# EAGLE design schemathic (EAGLE 9.1.3)
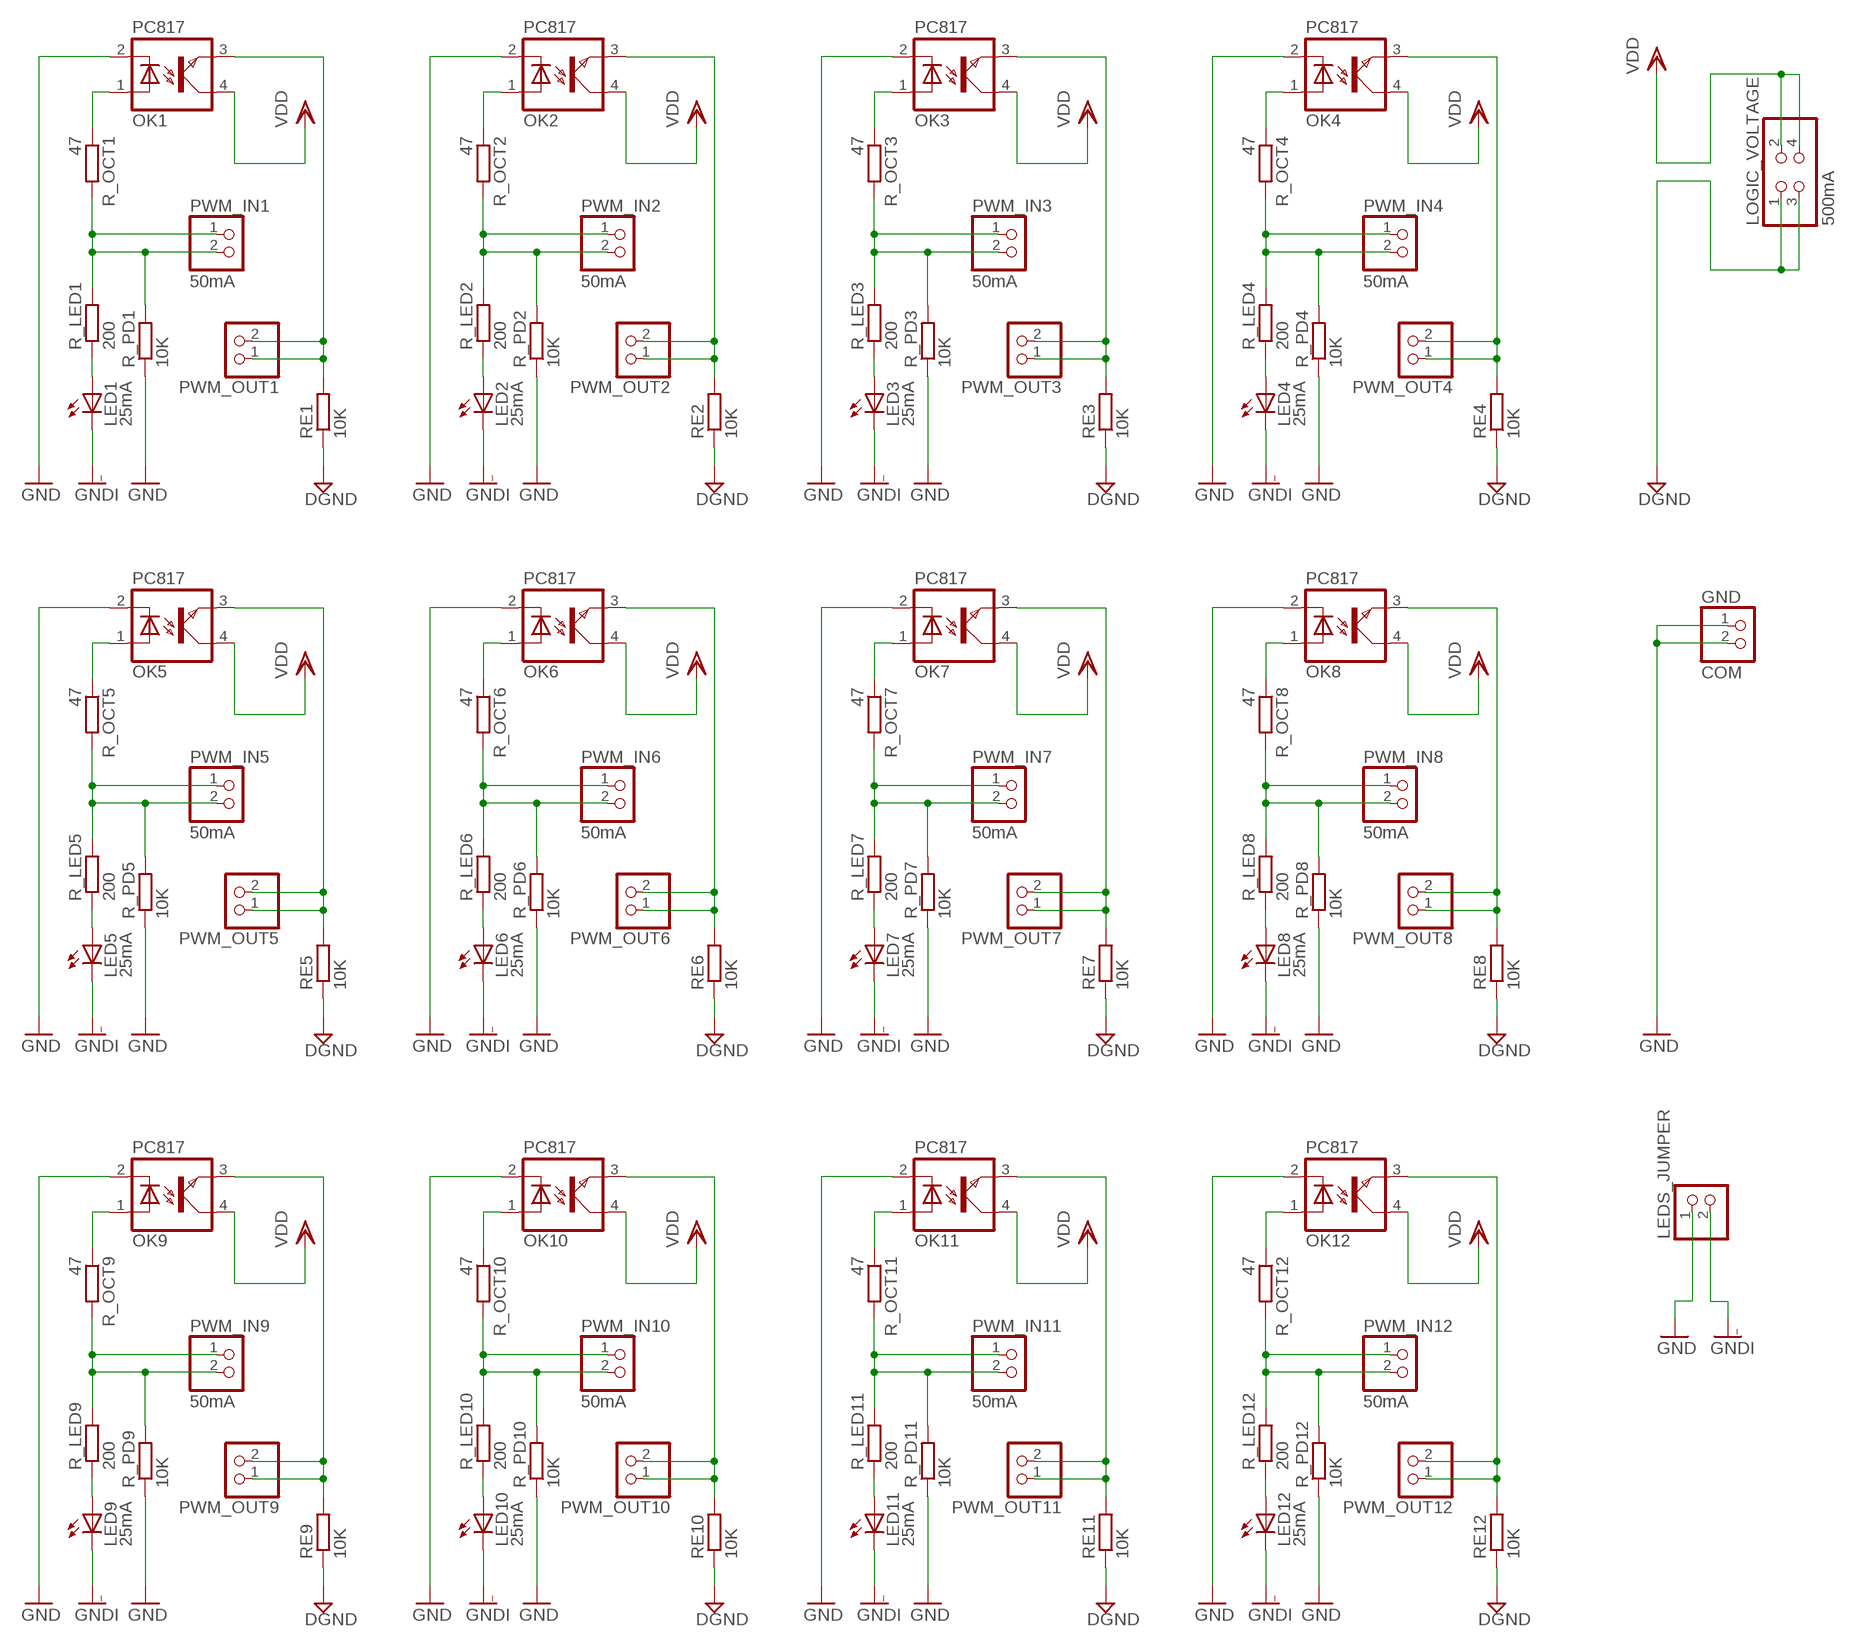
[diagram p0: schematic, sheet 1]

## Parts
GND  COM  PINHD-1X2  [1X02]
LED1  25mA  LED3MM  [LED3MM]
LED2  25mA  LED3MM  [LED3MM]
LED3  25mA  LED3MM  [LED3MM]
LED4  25mA  LED3MM  [LED3MM]
LED5  25mA  LED3MM  [LED3MM]
LED6  25mA  LED3MM  [LED3MM]
LED7  25mA  LED3MM  [LED3MM]
LED8  25mA  LED3MM  [LED3MM]
LED9  25mA  LED3MM  [LED3MM]
LED10  25mA  LED3MM  [LED3MM]
LED11  25mA  LED3MM  [LED3MM]
LED12  25mA  LED3MM  [LED3MM]
LEDS_JUMPER  PINHD-1X2  [1X02]
LOGIC_VOLTAGE  500mA  PINHD-2X2  [2X02]
OK1  PC817  [DIL04]
OK2  PC817  [DIL04]
OK3  PC817  [DIL04]
OK4  PC817  [DIL04]
OK5  PC817  [DIL04]
OK6  PC817  [DIL04]
OK7  PC817  [DIL04]
OK8  PC817  [DIL04]
OK9  PC817  [DIL04]
OK10  PC817  [DIL04]
OK11  PC817  [DIL04]
OK12  PC817  [DIL04]
PWM_IN1  50mA  PINHD-1X2  [1X02]
PWM_IN2  50mA  PINHD-1X2  [1X02]
PWM_IN3  50mA  PINHD-1X2  [1X02]
PWM_IN4  50mA  PINHD-1X2  [1X02]
PWM_IN5  50mA  PINHD-1X2  [1X02]
PWM_IN6  50mA  PINHD-1X2  [1X02]
PWM_IN7  50mA  PINHD-1X2  [1X02]
PWM_IN8  50mA  PINHD-1X2  [1X02]
PWM_IN9  50mA  PINHD-1X2  [1X02]
PWM_IN10  50mA  PINHD-1X2  [1X02]
PWM_IN11  50mA  PINHD-1X2  [1X02]
PWM_IN12  50mA  PINHD-1X2  [1X02]
PWM_OUT1  PINHD-1X2  [1X02]
PWM_OUT2  PINHD-1X2  [1X02]
PWM_OUT3  PINHD-1X2  [1X02]
PWM_OUT4  PINHD-1X2  [1X02]
PWM_OUT5  PINHD-1X2  [1X02]
PWM_OUT6  PINHD-1X2  [1X02]
PWM_OUT7  PINHD-1X2  [1X02]
PWM_OUT8  PINHD-1X2  [1X02]
PWM_OUT9  PINHD-1X2  [1X02]
PWM_OUT10  PINHD-1X2  [1X02]
PWM_OUT11  PINHD-1X2  [1X02]
PWM_OUT12  PINHD-1X2  [1X02]
R_LED1  200  R-EU_0204/7  [0204/7]
R_LED2  200  R-EU_0204/7  [0204/7]
R_LED3  200  R-EU_0204/7  [0204/7]
R_LED4  200  R-EU_0204/7  [0204/7]
R_LED5  200  R-EU_0204/7  [0204/7]
R_LED6  200  R-EU_0204/7  [0204/7]
R_LED7  200  R-EU_0204/7  [0204/7]
R_LED8  200  R-EU_0204/7  [0204/7]
R_LED9  200  R-EU_0204/7  [0204/7]
R_LED10  200  R-EU_0204/7  [0204/7]
R_LED11  200  R-EU_0204/7  [0204/7]
R_LED12  200  R-EU_0204/7  [0204/7]
R_OCT1  47  R-EU_0204/7  [0204/7]
R_OCT2  47  R-EU_0204/7  [0204/7]
R_OCT3  47  R-EU_0204/7  [0204/7]
R_OCT4  47  R-EU_0204/7  [0204/7]
R_OCT5  47  R-EU_0204/7  [0204/7]
R_OCT6  47  R-EU_0204/7  [0204/7]
R_OCT7  47  R-EU_0204/7  [0204/7]
R_OCT8  47  R-EU_0204/7  [0204/7]
R_OCT9  47  R-EU_0204/7  [0204/7]
R_OCT10  47  R-EU_0204/7  [0204/7]
R_OCT11  47  R-EU_0204/7  [0204/7]
R_OCT12  47  R-EU_0204/7  [0204/7]
R_PD1  10K  R-EU_0204/7  [0204/7]
R_PD2  10K  R-EU_0204/7  [0204/7]
R_PD3  10K  R-EU_0204/7  [0204/7]
R_PD4  10K  R-EU_0204/7  [0204/7]
R_PD5  10K  R-EU_0204/7  [0204/7]
R_PD6  10K  R-EU_0204/7  [0204/7]
R_PD7  10K  R-EU_0204/7  [0204/7]
R_PD8  10K  R-EU_0204/7  [0204/7]
R_PD9  10K  R-EU_0204/7  [0204/7]
R_PD10  10K  R-EU_0204/7  [0204/7]
R_PD11  10K  R-EU_0204/7  [0204/7]
R_PD12  10K  R-EU_0204/7  [0204/7]
RE1  10K  R-EU_0204/7  [0204/7]
RE2  10K  R-EU_0204/7  [0204/7]
RE3  10K  R-EU_0204/7  [0204/7]
RE4  10K  R-EU_0204/7  [0204/7]
RE5  10K  R-EU_0204/7  [0204/7]
RE6  10K  R-EU_0204/7  [0204/7]
RE7  10K  R-EU_0204/7  [0204/7]
RE8  10K  R-EU_0204/7  [0204/7]
RE9  10K  R-EU_0204/7  [0204/7]
RE10  10K  R-EU_0204/7  [0204/7]
RE11  10K  R-EU_0204/7  [0204/7]
RE12  10K  R-EU_0204/7  [0204/7]

## Nets
DGND: LOGIC_VOLTAGE.1 LOGIC_VOLTAGE.3 RE1.1 RE2.1 RE3.1 RE4.1 RE5.1 RE6.1 RE7.1 RE8.1 RE9.1 RE10.1 RE11.1 RE12.1
GND: GND.1 GND.2 LEDS_JUMPER.1 OK1.2(C) OK2.2(C) OK3.2(C) OK4.2(C) OK5.2(C) OK6.2(C) OK7.2(C) OK8.2(C) OK9.2(C) OK10.2(C) OK11.2(C) OK12.2(C) R_PD1.1 R_PD2.1 R_PD3.1 R_PD4.1 R_PD5.1 R_PD6.1 R_PD7.1 R_PD8.1 R_PD9.1 R_PD10.1 R_PD11.1 R_PD12.1
GNDI: LED1.K(C) LED2.K(C) LED3.K(C) LED4.K(C) LED5.K(C) LED6.K(C) LED7.K(C) LED8.K(C) LED9.K(C) LED10.K(C) LED11.K(C) LED12.K(C) LEDS_JUMPER.2
N$1: LED2.A R_LED2.1
N$2: LED1.A R_LED1.1
N$3: PWM_IN1.1 PWM_IN1.2 R_LED1.2 R_OCT1.2 R_PD1.2
N$4: OK1.1(A) R_OCT1.1
N$5: OK1.3(EMIT) PWM_OUT1.1 PWM_OUT1.2 RE1.2
N$6: PWM_IN2.1 PWM_IN2.2 R_LED2.2 R_OCT2.2 R_PD2.2
N$7: OK2.1(A) R_OCT2.1
N$8: OK2.3(EMIT) PWM_OUT2.1 PWM_OUT2.2 RE2.2
N$9: LED3.A R_LED3.1
N$10: PWM_IN3.1 PWM_IN3.2 R_LED3.2 R_OCT3.2 R_PD3.2
N$11: OK3.1(A) R_OCT3.1
N$12: OK3.3(EMIT) PWM_OUT3.1 PWM_OUT3.2 RE3.2
N$13: LED4.A R_LED4.1
N$14: PWM_IN4.1 PWM_IN4.2 R_LED4.2 R_OCT4.2 R_PD4.2
N$15: OK4.1(A) R_OCT4.1
N$16: OK4.3(EMIT) PWM_OUT4.1 PWM_OUT4.2 RE4.2
N$17: LED5.A R_LED5.1
N$18: PWM_IN5.1 PWM_IN5.2 R_LED5.2 R_OCT5.2 R_PD5.2
N$19: OK5.1(A) R_OCT5.1
N$20: OK5.3(EMIT) PWM_OUT5.1 PWM_OUT5.2 RE5.2
N$21: LED6.A R_LED6.1
N$22: PWM_IN6.1 PWM_IN6.2 R_LED6.2 R_OCT6.2 R_PD6.2
N$23: OK6.1(A) R_OCT6.1
N$24: OK6.3(EMIT) PWM_OUT6.1 PWM_OUT6.2 RE6.2
N$25: LED7.A R_LED7.1
N$26: PWM_IN7.1 PWM_IN7.2 R_LED7.2 R_OCT7.2 R_PD7.2
N$27: OK7.1(A) R_OCT7.1
N$28: OK7.3(EMIT) PWM_OUT7.1 PWM_OUT7.2 RE7.2
N$29: LED8.A R_LED8.1
N$30: PWM_IN8.1 PWM_IN8.2 R_LED8.2 R_OCT8.2 R_PD8.2
N$31: OK8.1(A) R_OCT8.1
N$32: OK8.3(EMIT) PWM_OUT8.1 PWM_OUT8.2 RE8.2
N$33: LED9.A R_LED9.1
N$34: PWM_IN9.1 PWM_IN9.2 R_LED9.2 R_OCT9.2 R_PD9.2
N$35: OK9.1(A) R_OCT9.1
N$36: OK9.3(EMIT) PWM_OUT9.1 PWM_OUT9.2 RE9.2
N$37: LED10.A R_LED10.1
N$38: PWM_IN10.1 PWM_IN10.2 R_LED10.2 R_OCT10.2 R_PD10.2
N$39: OK10.1(A) R_OCT10.1
N$40: OK10.3(EMIT) PWM_OUT10.1 PWM_OUT10.2 RE10.2
N$41: LED11.A R_LED11.1
N$42: PWM_IN11.1 PWM_IN11.2 R_LED11.2 R_OCT11.2 R_PD11.2
N$43: OK11.1(A) R_OCT11.1
N$44: OK11.3(EMIT) PWM_OUT11.1 PWM_OUT11.2 RE11.2
N$45: LED12.A R_LED12.1
N$46: PWM_IN12.1 PWM_IN12.2 R_LED12.2 R_OCT12.2 R_PD12.2
N$47: OK12.1(A) R_OCT12.1
N$48: OK12.3(EMIT) PWM_OUT12.1 PWM_OUT12.2 RE12.2
VDD: LOGIC_VOLTAGE.2 LOGIC_VOLTAGE.4 OK1.4(COL) OK2.4(COL) OK3.4(COL) OK4.4(COL) OK5.4(COL) OK6.4(COL) OK7.4(COL) OK8.4(COL) OK9.4(COL) OK10.4(COL) OK11.4(COL) OK12.4(COL)

## Library data of the parts
GND LEDS_JUMPER PWM_IN1-PWM_IN12 PWM_OUT1-PWM_OUT12 = pinhead:PINHD-1X2: PIN HEADER
LED1-LED12 = led:LED: LED OSRAM: - CHIPLED LG R971, LG N971, LY N971, LG Q971, LY Q971, LO R971, LY R971 LH N974, LH R974 LS Q976, LO Q976, LY Q976 LO Q996 - Hyper CHIPLED LW Q18S LB Q993, LB Q99A, LB R99A - SideLED LS A670, LO A670, LY A670, LG A670, LP A670 LB A673, LV A673, LT A673, LW A673 LH A674 LY A675 LS A676, LA A676, LO A676, LY A676, LW A676 LS A679, LY A679, LG A679 - Hyper Micro SIDELED® LS Y876, LA Y876, LO Y876, LY Y876 LT Y87S - SmartLED LW L88C, LW L88S LB L89C, LB L89S, LG L890 LS L89K, LO L89K, LY L89K LS L896, LA L896, LO L896, LY L896 - TOPLED LS T670, LO T670, LY T670, LG T670, LP T670 LSG T670, LSP T670, LSY T670, LOP T670, LYG T670 LG T671, LOG T671, LSG T671 LB T673, LV T673, LT T673, LW T673 LH T674 LS T676, LA T676, LO T676, LY T676, LB T676, LH T676, LSB T676, LW T676 LB T67C, LV T67C, LT T67C, LS T67K, LO T67K, LY T67K, LW E67C LS E67B, LA E67B, LO E67B, LY E67B, LB E67C, LV E67C, LT E67C LW T67C LS T679, LY T679, LG T679 LS T770, LO T770, LY T770, LG T770, LP T770 LB T773, LV T773, LT T773, LW T773 LH T774 LS E675, LA E675, LY E675, LS T675 LS T776, LA T776, LO T776, LY T776, LB T776 LHGB T686 LT T68C, LB T68C - Hyper Mini TOPLED® LB M676 - Mini TOPLED Santana® LG M470 LS M47K, LO M47K, LY M47K Source: http://www.osram.convergy.de LUXEON: - LUMILED® LXK2-PW12-R00, LXK2-PW12-S00, LXK2-PW14-U00, LXK2-PW14-V00 LXK2-PM12-R00, LXK2-PM12-S00, LXK2-PM14-U00 LXK2-PE12-Q00, LXK2-PE12-R00, LXK2-PE12-S00, LXK2-PE14-T00, LXK2-PE14-U00 LXK2-PB12-K00, LXK2-PB12-L00, LXK2-PB12-M00, LXK2-PB14-N00, LXK2-PB14-P00, LXK2-PB14-Q00 LXK2-PR12-L00, LXK2-PR12-M00, LXK2-PR14-Q00, LXK2-PR14-R00 LXK2-PD12-Q00, LXK2-PD12-R00, LXK2-PD12-S00 LXK2-PH12-R00, LXK2-PH12-S00 LXK2-PL12-P00, LXK2-PL12-Q00, LXK2-PL12-R00 Source: www.luxeon.com KINGBRIGHT: KA-3528ASYC Source: www.kingbright.com
LOGIC_VOLTAGE = pinhead:PINHD-2X2: PIN HEADER
OK1-OK12 = optocoupler:PC817: SHARP OPTO COUPLER; MPN: PC817X4J000F; OC_FARNELL: 9707727; OC_NEWARK: 97K7059
R_LED1-R_LED12 R_OCT1-R_OCT12 R_PD1-R_PD12 RE1-RE12 = rcl:R-EU_: RESISTOR, European symbol; SPICEPREFIX: R

## Board
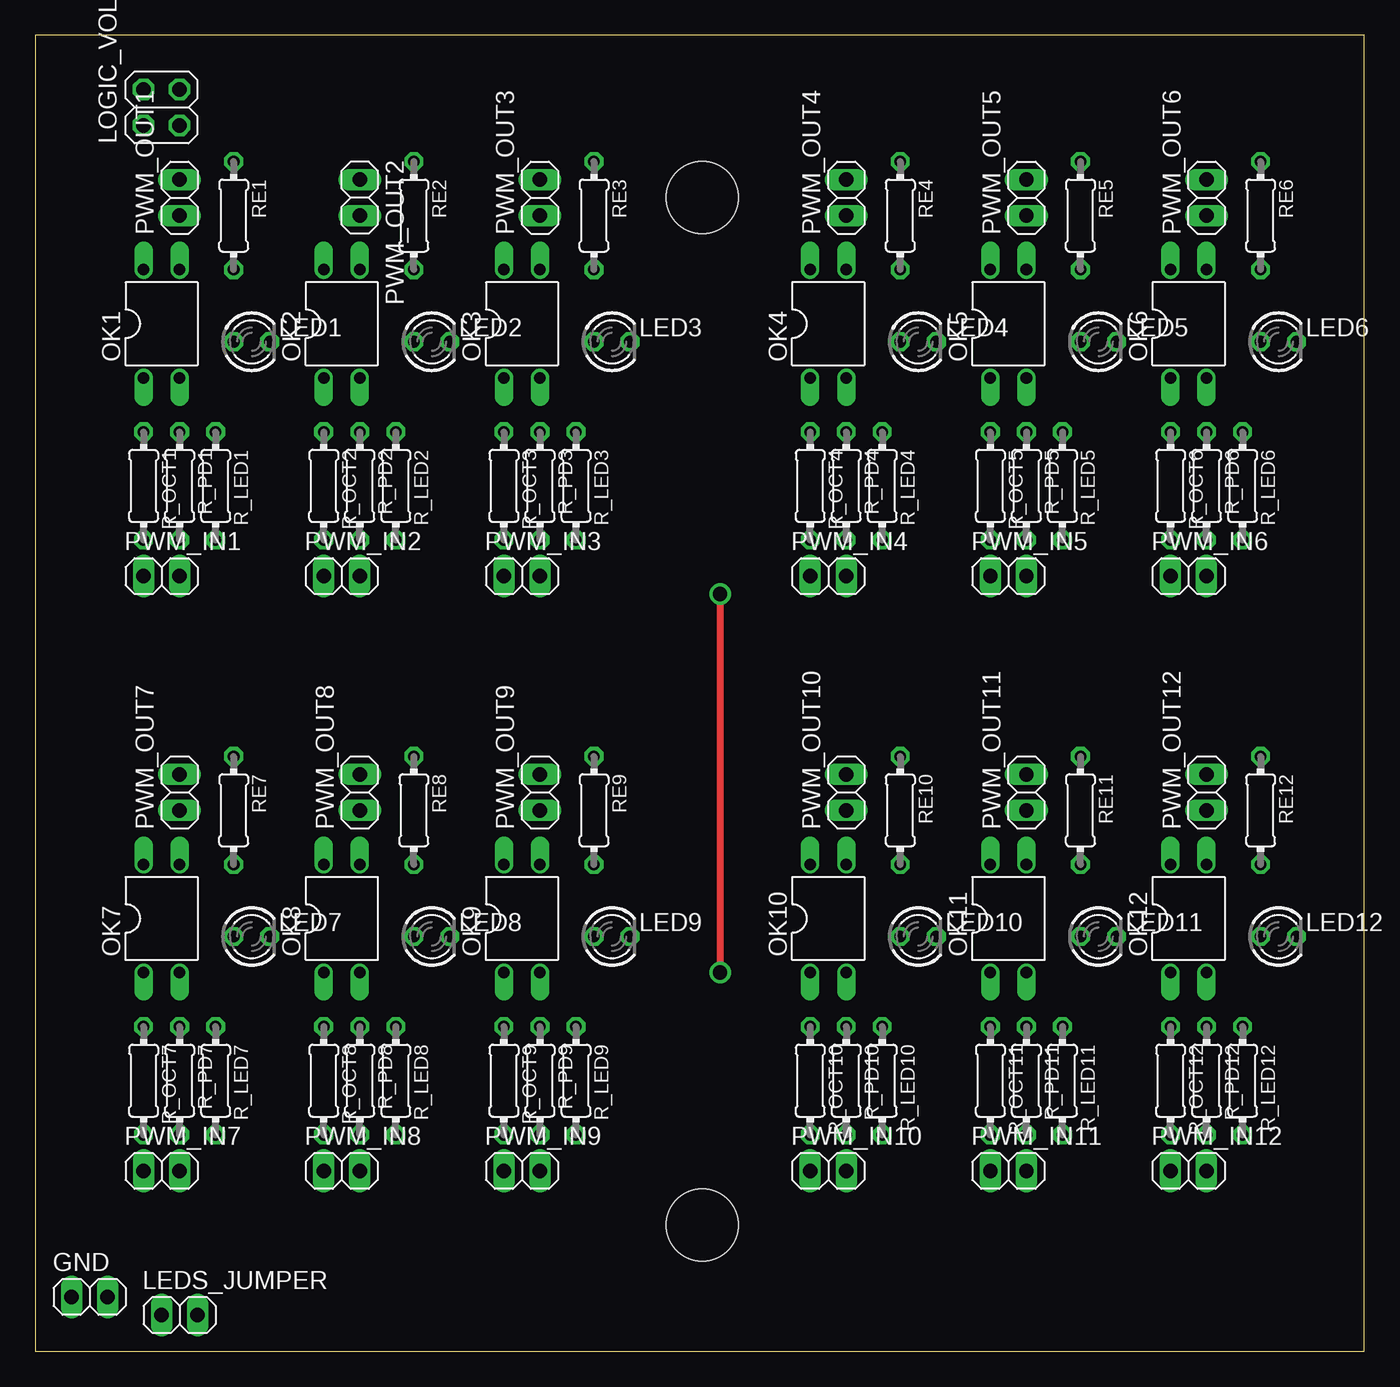
[diagram p1: board, top side]
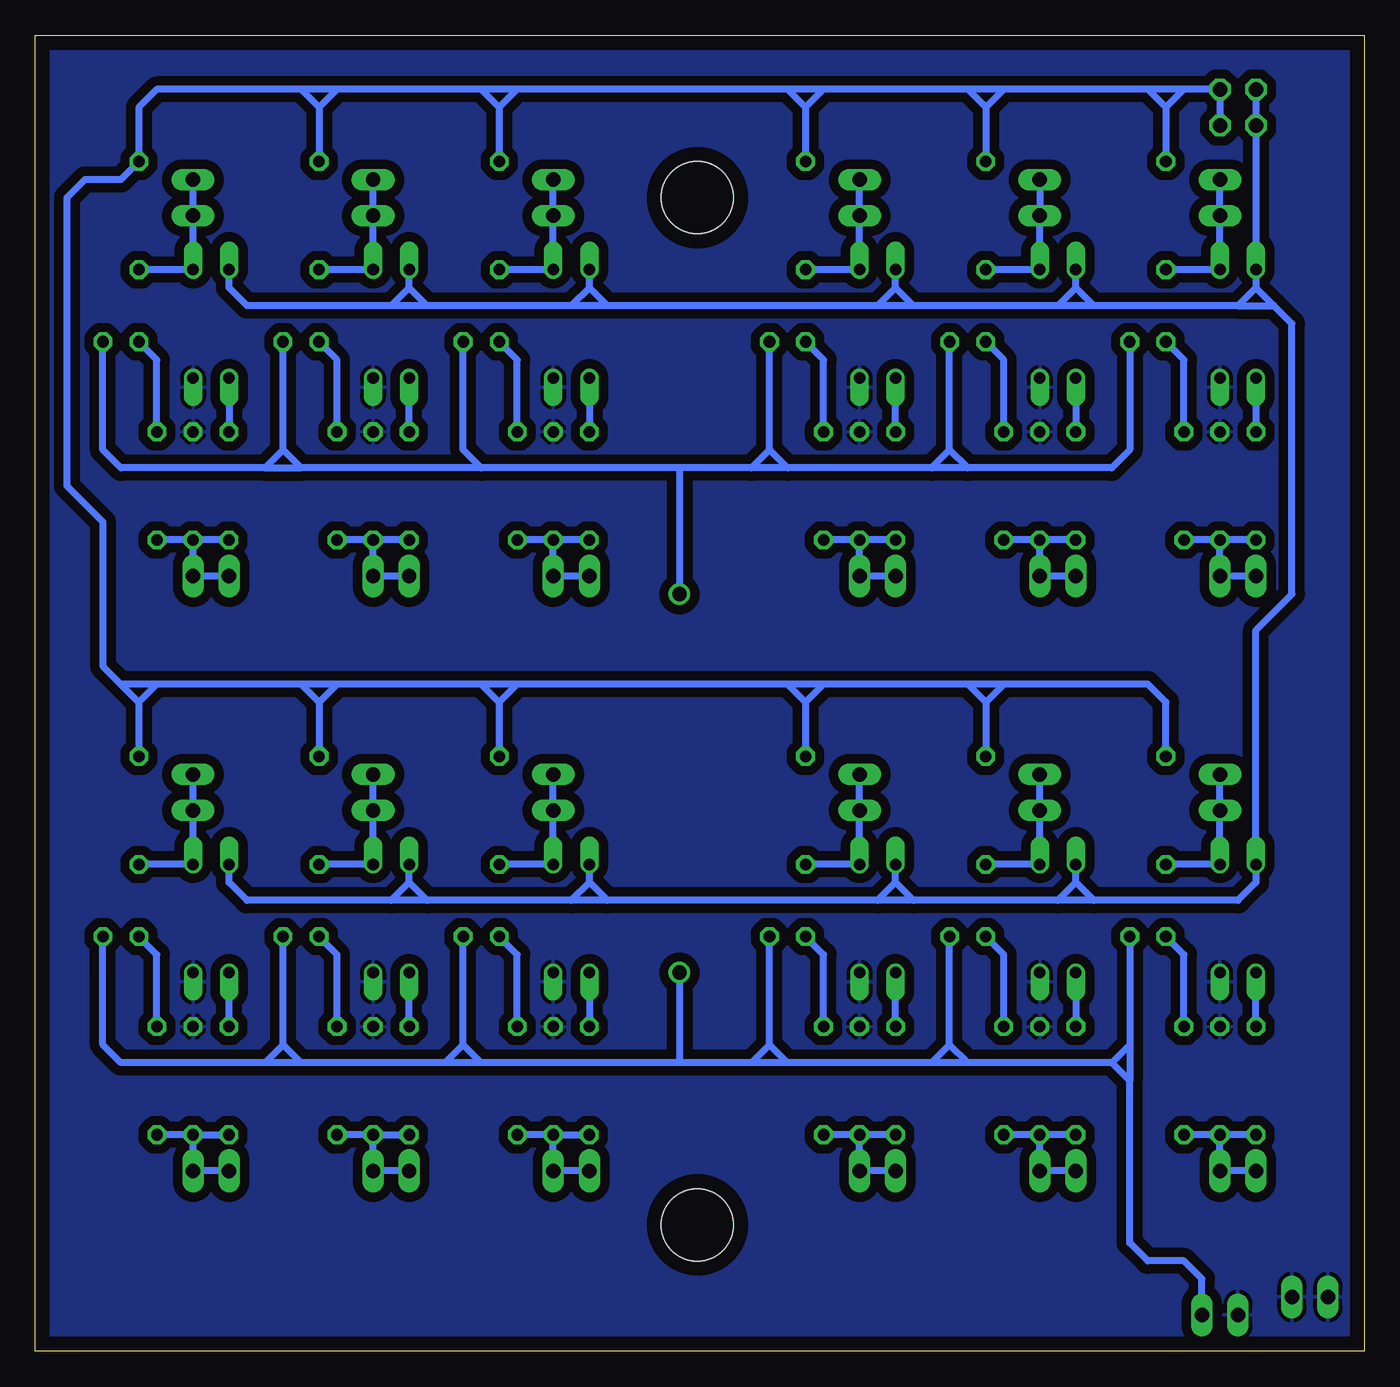
[diagram p2: board, bottom side, seen from below]

Size 93.65 x 92.7 mm. Coordinates in mm from the lower left corner, seen from the top.
Outline: 0,0 93.65,0 93.65,92.7 0,92.7 0,0
Copper layers (1*16): Top 0.035mm / dielectric 1.5mm / Bottom 0.035mm
Design rules "default *": minimum track width 6mil, minimum drill 0.35mm, track to track 26mil, track to pad 26mil, pad to pad 26mil, via to via 26mil, smd to smd 6mil, copper to edge 40mil, drill to drill 6mil, minimum pad ring 10mil, minimum via ring 8mil, stop-mask expansion 4mil, vias tented up to drill 0mil, thermal gap 10mil
Holes 5.08 mm at 46.99,8.89 46.99,81.28

### Footprints (pad centres in the part's own frame; a part is rotated, then mirrored left to right if it is on the bottom)
1X02 = drill 1.016 long: 1 -1.27,0; 2 1.27,0
LED3MM = drill 0.813 octagon: A -1.27,0; K 1.27,0
2X02 = drill 1.016 octagon: 1 -1.27,-1.27; 2 -1.27,1.27; 3 1.27,-1.27; 4 1.27,1.27
DIL04 = drill 0.813 offset: 1 -1.27,-3.81; 2 1.27,-3.81; 3 1.27,3.81; 4 -1.27,3.81
0204/7 = drill 0.813 octagon: 1 -3.81,0; 2 3.81,0

### Placement (x,y rotation side)
GND  3.81,3.81 0 top
LED1  15.24,71.12 0 top
LED2  27.94,71.12 0 top
LED3  40.64,71.12 0 top
LED4  62.23,71.12 0 top
LED5  74.93,71.12 0 top
LED6  87.63,71.12 0 top
LED7  15.24,29.21 0 top
LED8  27.94,29.21 0 top
LED9  40.64,29.21 0 top
LED10  62.23,29.21 0 top
LED11  74.93,29.21 0 top
LED12  87.63,29.21 0 top
LEDS_JUMPER  10.16,2.54 0 top
LOGIC_VOLTAGE  8.89,87.63 90 top
OK1  8.89,72.39 0 top
OK2  21.59,72.39 0 top
OK3  34.29,72.39 0 top
OK4  55.88,72.39 0 top
OK5  68.58,72.39 0 top
OK6  81.28,72.39 0 top
OK7  8.89,30.48 0 top
OK8  21.59,30.48 0 top
OK9  34.29,30.48 0 top
OK10  55.88,30.48 0 top
OK11  68.58,30.48 0 top
OK12  81.28,30.48 0 top
PWM_IN1  8.89,54.61 0 top
PWM_IN2  21.59,54.61 0 top
PWM_IN3  34.29,54.61 0 top
PWM_IN4  55.88,54.61 0 top
PWM_IN5  68.58,54.61 0 top
PWM_IN6  81.28,54.61 0 top
PWM_IN7  8.89,12.7 0 top
PWM_IN8  21.59,12.7 0 top
PWM_IN9  34.29,12.7 0 top
PWM_IN10  55.88,12.7 0 top
PWM_IN11  68.58,12.7 0 top
PWM_IN12  81.28,12.7 0 top
PWM_OUT1  10.16,81.28 90 top
PWM_OUT2  22.86,81.28 270 top
PWM_OUT3  35.56,81.28 90 top
PWM_OUT4  57.15,81.28 90 top
PWM_OUT5  69.85,81.28 90 top
PWM_OUT6  82.55,81.28 90 top
PWM_OUT7  10.16,39.37 90 top
PWM_OUT8  22.86,39.37 90 top
PWM_OUT9  35.56,39.37 90 top
PWM_OUT10  57.15,39.37 90 top
PWM_OUT11  69.85,39.37 90 top
PWM_OUT12  82.55,39.37 90 top
R_LED1  12.7,60.96 270 top
R_LED2  25.4,60.96 270 top
R_LED3  38.1,60.96 270 top
R_LED4  59.69,60.96 270 top
R_LED5  72.39,60.96 270 top
R_LED6  85.09,60.96 270 top
R_LED7  12.7,19.05 270 top
R_LED8  25.4,19.05 270 top
R_LED9  38.1,19.05 270 top
R_LED10  59.69,19.05 270 top
R_LED11  72.39,19.05 270 top
R_LED12  85.09,19.05 270 top
R_OCT1  7.62,60.96 270 top
R_OCT2  20.32,60.96 270 top
R_OCT3  33.02,60.96 270 top
R_OCT4  54.61,60.96 270 top
R_OCT5  67.31,60.96 270 top
R_OCT6  80.01,60.96 270 top
R_OCT7  7.62,19.05 270 top
R_OCT8  20.32,19.05 270 top
R_OCT9  33.02,19.05 270 top
R_OCT10  54.61,19.05 270 top
R_OCT11  67.31,19.05 270 top
R_OCT12  80.01,19.05 270 top
R_PD1  10.16,60.96 270 top
R_PD2  22.86,60.96 270 top
R_PD3  35.56,60.96 270 top
R_PD4  57.15,60.96 270 top
R_PD5  69.85,60.96 270 top
R_PD6  82.55,60.96 270 top
R_PD7  10.16,19.05 270 top
R_PD8  22.86,19.05 270 top
R_PD9  35.56,19.05 270 top
R_PD10  57.15,19.05 270 top
R_PD11  69.85,19.05 270 top
R_PD12  82.55,19.05 270 top
RE1  13.97,80.01 270 top
RE2  26.67,80.01 270 top
RE3  39.37,80.01 270 top
RE4  60.96,80.01 270 top
RE5  73.66,80.01 270 top
RE6  86.36,80.01 270 top
RE7  13.97,38.1 270 top
RE8  26.67,38.1 270 top
RE9  39.37,38.1 270 top
RE10  60.96,38.1 270 top
RE11  73.66,38.1 270 top
RE12  86.36,38.1 270 top

### Tracks (layer width: path | path; a pad name or v marks a point on that pad's centre or on a via)
DGND
  Bottom 0.508: LOGIC_VOLTAGE.1 LOGIC_VOLTAGE.3 12.7,88.9 | 12.7,88.9 13.97,87.63 | 13.97,87.63 RE1.1 | 15.24,88.9 25.4,88.9 | 25.4,88.9 26.67,87.63 | 26.67,87.63 RE2.1 | 13.97,87.63 15.24,88.9 | 25.4,88.9 27.94,88.9 | 27.94,88.9 38.1,88.9 | 38.1,88.9 39.37,87.63 | 39.37,87.63 RE3.1 | 38.1,88.9 40.64,88.9 | 40.64,88.9 59.69,88.9 | 59.69,88.9 60.96,87.63 | 60.96,87.63 RE4.1 | 26.67,87.63 27.94,88.9 | 12.7,88.9 15.24,88.9 | 39.37,87.63 40.64,88.9 | 60.96,87.63 62.23,88.9 | 62.23,88.9 72.39,88.9 | 72.39,88.9 73.66,87.63 | 73.66,87.63 RE5.1 | 59.69,88.9 62.23,88.9 | 73.66,87.63 74.93,88.9 | 74.93,88.9 85.09,88.9 86.36,87.63 RE6.1 87.63,82.55 90.17,82.55 91.44,81.28 91.44,60.96 88.9,58.42 88.9,48.26 87.63,46.99 | 72.39,88.9 74.93,88.9 | RE7.1 13.97,45.72 15.24,46.99 25.4,46.99 | 25.4,46.99 26.67,45.72 | 26.67,45.72 RE8.1 | 25.4,46.99 27.94,46.99 | 27.94,46.99 38.1,46.99 | 38.1,46.99 39.37,45.72 | 39.37,45.72 RE9.1 | 38.1,46.99 40.64,46.99 | 40.64,46.99 59.69,46.99 | 59.69,46.99 60.96,45.72 | 60.96,45.72 RE10.1 | 59.69,46.99 62.23,46.99 | 62.23,46.99 72.39,46.99 | 72.39,46.99 73.66,45.72 | 73.66,45.72 RE11.1 | 72.39,46.99 74.93,46.99 | 74.93,46.99 85.09,46.99 | 85.09,46.99 86.36,45.72 | 86.36,45.72 RE12.1 | 26.67,45.72 27.94,46.99 | 39.37,45.72 40.64,46.99 | 62.23,46.99 60.96,45.72 | 73.66,45.72 74.93,46.99 | 87.63,46.99 86.36,45.72 | 85.09,46.99 87.63,46.99
GND
  pour Bottom: -8.89,99.06 -8.89,3.81 -2.54,-2.54 97.79,-2.54 101.6,1.27 105.41,5.08 105.41,101.6 -6.35,101.6
GNDI  (via drill 1)
  Top 0.508: v48.26,53.34 v48.26,26.67
  Bottom 0.508: LED1.K 16.51,63.5 17.78,62.23 27.94,62.23 | 27.94,62.23 29.21,63.5 | 29.21,63.5 LED2.K | 40.64,62.23 41.91,63.5 | 41.91,63.5 LED3.K | 27.94,62.23 30.48,62.23 | 30.48,62.23 40.64,62.23 | 29.21,63.5 30.48,62.23 | 41.91,63.5 43.18,62.23 | 43.18,62.23 48.26,62.23 | 48.26,62.23 62.23,62.23 | 62.23,62.23 63.5,63.5 LED4.K | 40.64,62.23 43.18,62.23 | 62.23,62.23 74.93,62.23 | 74.93,62.23 76.2,63.5 | 76.2,63.5 LED5.K | LED7.K 16.51,21.59 | 16.51,21.59 17.78,20.32 | 17.78,20.32 27.94,20.32 | 27.94,20.32 29.21,21.59 | 29.21,21.59 LED8.K | 27.94,20.32 30.48,20.32 | 30.48,20.32 40.64,20.32 | 40.64,20.32 41.91,21.59 | 41.91,21.59 LED9.K | 29.21,21.59 30.48,20.32 | 41.91,21.59 43.18,20.32 | 43.18,20.32 48.26,20.32 | 48.26,20.32 62.23,20.32 | 62.23,20.32 63.5,21.59 | 63.5,21.59 LED10.K | 63.5,21.59 64.77,20.32 | 64.77,20.32 74.93,20.32 | 74.93,20.32 76.2,21.59 | 76.2,21.59 LED11.K | 76.2,21.59 77.47,20.32 | 77.47,20.32 87.63,20.32 88.9,21.59 LED12.K | 62.23,20.32 64.77,20.32 | 74.93,20.32 77.47,20.32 | 40.64,20.32 43.18,20.32 | 76.2,63.5 77.47,62.23 | 77.47,62.23 87.63,62.23 88.9,63.5 LED6.K | 77.47,62.23 74.93,62.23 | LEDS_JUMPER.2 11.43,5.08 12.7,6.35 15.24,6.35 16.51,7.62 16.51,19.05 | 16.51,19.05 17.78,20.32 | 16.51,21.59 16.51,19.05 | v48.26,26.67 48.26,20.32 | 48.26,62.23 v48.26,53.34
N$1
  Bottom 0.508: R_LED2.1 25.4,69.85 LED2.A
N$2
  Bottom 0.508: R_LED1.1 12.7,69.85 LED1.A
N$3
  Bottom 0.508: R_OCT1.2 R_PD1.2 | R_PD1.2 R_LED1.2 | PWM_IN1.1 PWM_IN1.2 R_PD1.2
N$4
  Bottom 0.508: OK1.1 R_OCT1.1
N$5
  Bottom 0.508: PWM_OUT1.2 PWM_OUT1.1 OK1.3 RE1.2
N$6
  Bottom 0.508: R_OCT2.2 R_PD2.2 | R_PD2.2 R_LED2.2 | PWM_IN2.1 PWM_IN2.2 R_PD2.2
N$7
  Bottom 0.508: OK2.1 R_OCT2.1
N$8
  Bottom 0.508: PWM_OUT2.1 PWM_OUT2.2 OK2.3 RE2.2
N$9
  Bottom 0.508: R_LED3.1 38.1,69.85 LED3.A
N$10
  Bottom 0.508: PWM_IN3.1 PWM_IN3.2 R_PD3.2 | R_OCT3.2 R_PD3.2 | R_PD3.2 R_LED3.2
N$11
  Bottom 0.508: R_OCT3.1 OK3.1
N$12
  Bottom 0.508: PWM_OUT3.2 PWM_OUT3.1 OK3.3 RE3.2
N$13
  Bottom 0.508: R_LED4.1 59.69,69.85 LED4.A
N$14
  Bottom 0.508: R_OCT4.2 R_PD4.2 | R_PD4.2 R_LED4.2 | PWM_IN4.1 PWM_IN4.2 R_PD4.2
N$15
  Bottom 0.508: OK4.1 R_OCT4.1
N$16
  Bottom 0.508: PWM_OUT4.2 PWM_OUT4.1 OK4.3 RE4.2
N$17
  Bottom 0.508: R_LED5.1 72.39,69.85 LED5.A
N$18
  Bottom 0.508: PWM_IN5.1 PWM_IN5.2 R_PD5.2 | R_OCT5.2 R_PD5.2 | R_PD5.2 R_LED5.2
N$19
  Bottom 0.508: R_OCT5.1 OK5.1
N$20
  Bottom 0.508: RE5.2 OK5.3 PWM_OUT5.1 PWM_OUT5.2
N$21
  Bottom 0.508: R_LED6.1 85.09,69.85 LED6.A
N$22
  Bottom 0.508: R_OCT6.2 R_PD6.2 | R_PD6.2 R_LED6.2 | PWM_IN6.1 PWM_IN6.2 R_PD6.2
N$23
  Bottom 0.508: OK6.1 R_OCT6.1
N$24
  Bottom 0.508: PWM_OUT6.2 PWM_OUT6.1 OK6.3 RE6.2
N$25
  Bottom 0.508: R_LED7.1 12.7,27.94 LED7.A
N$26
  Bottom 0.508: PWM_IN7.1 PWM_IN7.2 R_PD7.2 | R_OCT7.2 R_PD7.2 | R_PD7.2 R_LED7.2
N$27
  Bottom 0.508: R_OCT7.1 OK7.1
N$28
  Bottom 0.508: PWM_OUT7.2 PWM_OUT7.1 OK7.3 RE7.2
N$29
  Bottom 0.508: R_LED8.1 25.4,27.94 LED8.A
N$30
  Bottom 0.508: R_OCT8.2 R_PD8.2 | R_PD8.2 R_LED8.2 | PWM_IN8.1 PWM_IN8.2 R_PD8.2
N$31
  Bottom 0.508: OK8.1 R_OCT8.1
N$32
  Bottom 0.508: PWM_OUT8.2 PWM_OUT8.1 OK8.3 RE8.2
N$33
  Bottom 0.508: R_LED9.1 38.1,27.94 LED9.A
N$34
  Bottom 0.508: PWM_IN9.1 PWM_IN9.2 R_PD9.2 | R_OCT9.2 R_PD9.2 | R_PD9.2 R_LED9.2
N$35
  Bottom 0.508: R_OCT9.1 OK9.1
N$36
  Bottom 0.508: RE9.2 OK9.3 PWM_OUT9.1 PWM_OUT9.2
N$37
  Bottom 0.508: R_LED10.1 59.69,27.94 LED10.A
N$38
  Bottom 0.508: PWM_IN10.1 PWM_IN10.2 R_PD10.2 | R_PD10.2 R_LED10.2 | R_PD10.2 R_OCT10.2
N$39
  Bottom 0.508: OK10.1 R_OCT10.1
N$40
  Bottom 0.508: PWM_OUT10.2 PWM_OUT10.1 OK10.3 RE10.2
N$41
  Bottom 0.508: R_LED11.1 72.39,27.94 LED11.A
N$42
  Bottom 0.508: PWM_IN11.1 PWM_IN11.2 R_PD11.2 | R_PD11.2 R_OCT11.2 | R_PD11.2 R_LED11.2
N$43
  Bottom 0.508: R_OCT11.1 OK11.1
N$44
  Bottom 0.508: PWM_OUT11.2 PWM_OUT11.1 OK11.3 RE11.2
N$45
  Bottom 0.508: R_LED12.1 85.09,27.94 LED12.A
N$46
  Bottom 0.508: PWM_IN12.1 PWM_IN12.2 R_PD12.2 | R_PD12.2 R_OCT12.2 | R_PD12.2 R_LED12.2
N$47
  Bottom 0.508: R_OCT12.1 OK12.1
N$48
  Bottom 0.508: RE12.2 OK12.3 PWM_OUT12.1 PWM_OUT12.2
VDD
  Bottom 0.508: LOGIC_VOLTAGE.4 LOGIC_VOLTAGE.2 OK1.4 7.62,74.93 | 7.62,74.93 8.89,73.66 | 8.89,73.66 19.05,73.66 | 19.05,73.66 20.32,74.93 | 20.32,74.93 OK2.4 | 19.05,73.66 21.59,73.66 | 21.59,73.66 31.75,73.66 | 31.75,73.66 33.02,74.93 | 33.02,74.93 OK3.4 | 31.75,73.66 34.29,73.66 | 34.29,73.66 53.34,73.66 | 53.34,73.66 54.61,74.93 | 54.61,74.93 OK4.4 | 20.32,74.93 21.59,73.66 | 33.02,74.93 34.29,73.66 | 53.34,73.66 55.88,73.66 | 55.88,73.66 66.04,73.66 | 66.04,73.66 67.31,74.93 | 67.31,74.93 OK5.4 | 66.04,73.66 68.58,73.66 | 68.58,73.66 78.74,73.66 80.01,74.93 OK6.4 | 54.61,74.93 55.88,73.66 | 67.31,74.93 68.58,73.66 | 19.05,31.75 8.89,31.75 7.62,33.02 OK7.4 7.62,50.8 5.08,53.34 5.08,72.39 6.35,73.66 | 19.05,31.75 20.32,33.02 | 20.32,33.02 OK8.4 | 19.05,31.75 21.59,31.75 | 21.59,31.75 31.75,31.75 | 31.75,31.75 33.02,33.02 | 33.02,33.02 OK9.4 | 31.75,31.75 34.29,31.75 | 34.29,31.75 53.34,31.75 | 53.34,31.75 54.61,33.02 | 54.61,33.02 OK10.4 | 53.34,31.75 55.88,31.75 | 55.88,31.75 66.04,31.75 | 66.04,31.75 67.31,33.02 | 67.31,33.02 OK11.4 | 66.04,31.75 68.58,31.75 | 68.58,31.75 78.74,31.75 80.01,33.02 OK12.4 | 54.61,33.02 55.88,31.75 | 67.31,33.02 68.58,31.75 | 33.02,33.02 34.29,31.75 | 20.32,33.02 21.59,31.75 | 7.62,74.93 6.35,73.66 | 8.89,73.66 6.35,73.66